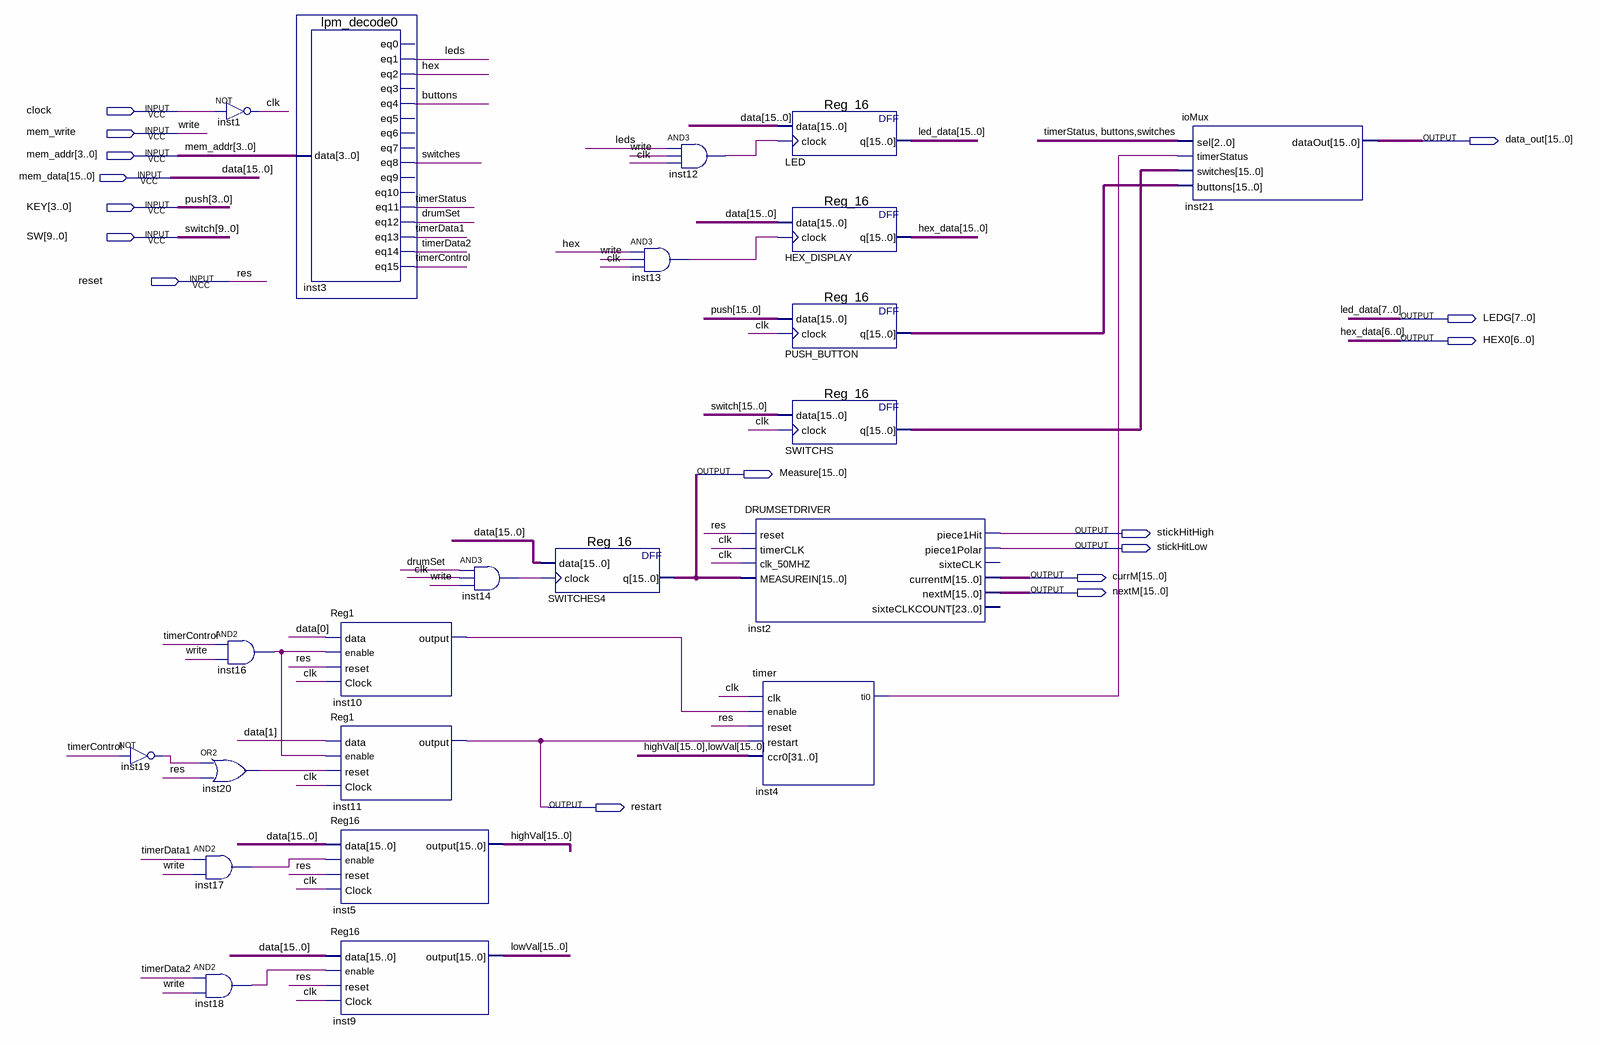
[diagram p0: schematic sheet]
// Quartus schematic IO_MemoryInterface.bdf as structural Verilog: 22 symbols, 16 pins
module IO_MemoryInterface (
  input  clock,
  input  mem_write,
  input  [3:0] mem_addr,
  input  [15:0] mem_data,
  input  [3:0] KEY,
  input  [9:0] SW,
  input  reset,
  output [15:0] data_out,
  output [7:0] LEDG,
  output [6:0] HEX0,
  output [15:0] Measure,
  output stickHitHigh,
  output stickHitLow,
  output [15:0] currM,
  output [15:0] nextM,
  output restart
);

  wire buttons, clk, drumSet, hex, inst4_ti0, inst10_output, inst12_out, inst13_out, inst14_out, inst16_out,
       inst17_out, inst18_out, inst19_out, inst20_out, leds, switches, timerControl, timerData1, timerData2,
       timerStatus;
  wire [15:0] highVal, lowVal, PUSH_BUTTON_q, SWITCHS_q;
  wire [15:4] push;
  wire [15:7] hex_data;
  wire [15:8] led_data;
  wire [15:10] switch;

  not inst19 (inst19_out, timerControl);
  not inst1 (clk, clock);
  and inst16 (inst16_out, timerControl, mem_write);
  or inst20 (inst20_out, inst19_out, reset);
  and inst17 (inst17_out, timerData1, mem_write);
  and inst18 (inst18_out, timerData2, mem_write);
  lpm_decode0 inst3 (
    .data(mem_addr), .eq1(leds), .eq2(hex), .eq4(buttons), .eq8(switches), .eq11(timerStatus),
    .eq12(drumSet), .eq13(timerData1), .eq14(timerData2), .eq15(timerControl));  // open: eq0, eq3, eq5, eq6, eq7, eq9, eq10
  Reg1 inst10 (.data(mem_data[0]), .enable(inst16_out), .reset(reset), .Clock(clk), .\output (inst10_output));
  Reg1 inst11 (.data(mem_data[1]), .enable(inst16_out), .reset(inst20_out), .Clock(clk), .\output (restart));
  Reg16 inst5 (.data(mem_data), .enable(inst17_out), .reset(reset), .Clock(clk), .\output (highVal));
  Reg16 inst9 (.data(mem_data), .enable(inst18_out), .reset(reset), .Clock(clk), .\output (lowVal));
  and inst14 (inst14_out, drumSet, clk, mem_write);
  Reg_16 SWITCHES4 (.data(mem_data), .clock(inst14_out), .q(Measure));
  and inst13 (inst13_out, hex, mem_write, clk);
  and inst12 (inst12_out, leds, mem_write, clk);
  Reg_16 LED (.data(mem_data), .clock(inst12_out), .q({led_data, LEDG}));
  Reg_16 HEX_DISPLAY (.data(mem_data), .clock(inst13_out), .q({hex_data, HEX0}));
  Reg_16 PUSH_BUTTON (.data({push, KEY}), .clock(clk), .q(PUSH_BUTTON_q));
  Reg_16 SWITCHS (.data({switch, SW}), .clock(clk), .q(SWITCHS_q));
  DRUMSETDRIVER inst2 (
    .reset(reset), .timerCLK(clk), .clk_50MHZ(clk), .MEASUREIN(Measure), .piece1Hit(stickHitHigh),
    .piece1Polar(stickHitLow), .currentM(currM), .nextM(nextM));  // open: sixteCLK, sixteCLKCOUNT
  timer inst4 (
    .clk(clk), .enable(inst10_output), .reset(reset), .restart(restart), .ccr0({highVal, lowVal}),
    .ti0(inst4_ti0));
  ioMux inst21 (
    .sel({timerStatus, buttons, switches}), .timerStatus(inst4_ti0), .switches(SWITCHS_q),
    .buttons(PUSH_BUTTON_q), .dataOut(data_out));

  // Other names for the same wires on the sheet: data[15:0] = mem_data; hex_data[6:0] = HEX0; led_data[7:0] = LEDG;
  //   push[3:0] = KEY; res = reset; switch[9:0] = SW; write = mem_write
endmodule
